# Altium project SUSTAINIAC_BO.PrjPcb
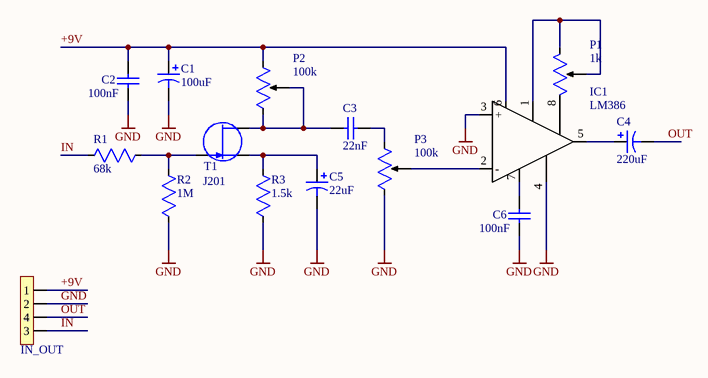
[diagram p0: SUSTAINIAC_BO.SchDoc]
1 sheet, 15 parts. Net scope: global (net labels, ports and power ports of the same name join across sheets).
Board file: SUSTAINIAC_BO.PcbDoc

## Sheet SUSTAINIAC_BO.SchDoc
size A4

### Parts
C1  value 100uF  [PANASONIC_C_BO]  (hidden comment: Capacitor_Pol)
C2  value 100nF  [SMD_1206_BO]  (hidden comment: Capacitor)
C3  value 22nF  [SMD_1206_BO]  (hidden comment: Capacitor)
C4  value 220uF  [PANASONIC_D8_BO]  (hidden comment: Capacitor_Pol)
C5  value 22uF  [PANASONIC_B_BO]  (hidden comment: Capacitor_Pol)
C6  value 100nF  [SMD_1206_BO]  (hidden comment: Capacitor)
Con1  IN_OUT  [Connector double]
IC1  LM386  [SO8_BO]
P1  Resistance: 1k  [POT_1801-J_BO]  (hidden comment: Potentiometer)
P2  Resistance: 100k  [POT_1801-J_BO]  (hidden comment: Potentiometer)
P3  Resistance: 100k  [POT_1801-J_BO]  (hidden comment: Potentiometer)
R1  Resistance: 68k  [SMD_1206_BO]  (hidden comment: Resistor)
R2  Resistance: 1M  [SMD_1206_BO]  (hidden comment: Resistor)
R3  Resistance: 1.5k  [SMD_1206_BO]  (hidden comment: Resistor)
T1  J201  [SOT23_BO]

### Nets
GND: C1.2 C2.1 C5.2 C6.1 Con1.2 IC1.3(+) IC1.4 P3.1 R2.1(OUT) R3.1(OUT)
+9V: C1.1 C2.2 Con1.1 IC1.6 P2.3
IN: Con1.3 R1.1(OUT)
OUT: C4.2 Con1.4
NetC3_1: C3.1 P2.1 P2.2 T1.2(S)
NetC3_2: C3.2 P3.3
NetC4_1: C4.1 IC1.5
NetC5_1: C5.1 R3.2(OUT) T1.1(D)
NetC6_2: C6.2 IC1.7
NetIC1_1: IC1.1 P1.1 P1.2
NetIC1_2: IC1.2(-) P3.2
NetIC1_8: IC1.8 P1.3
NetR1_2: R1.2(OUT) R2.2(OUT) T1.3(G)

### Library data of the parts
Con1 = CONNECTOR_4_PIN
T1 = JFET